# EAGLE design StormNet18-Remote-v0.1 (EAGLE 7.7.0)
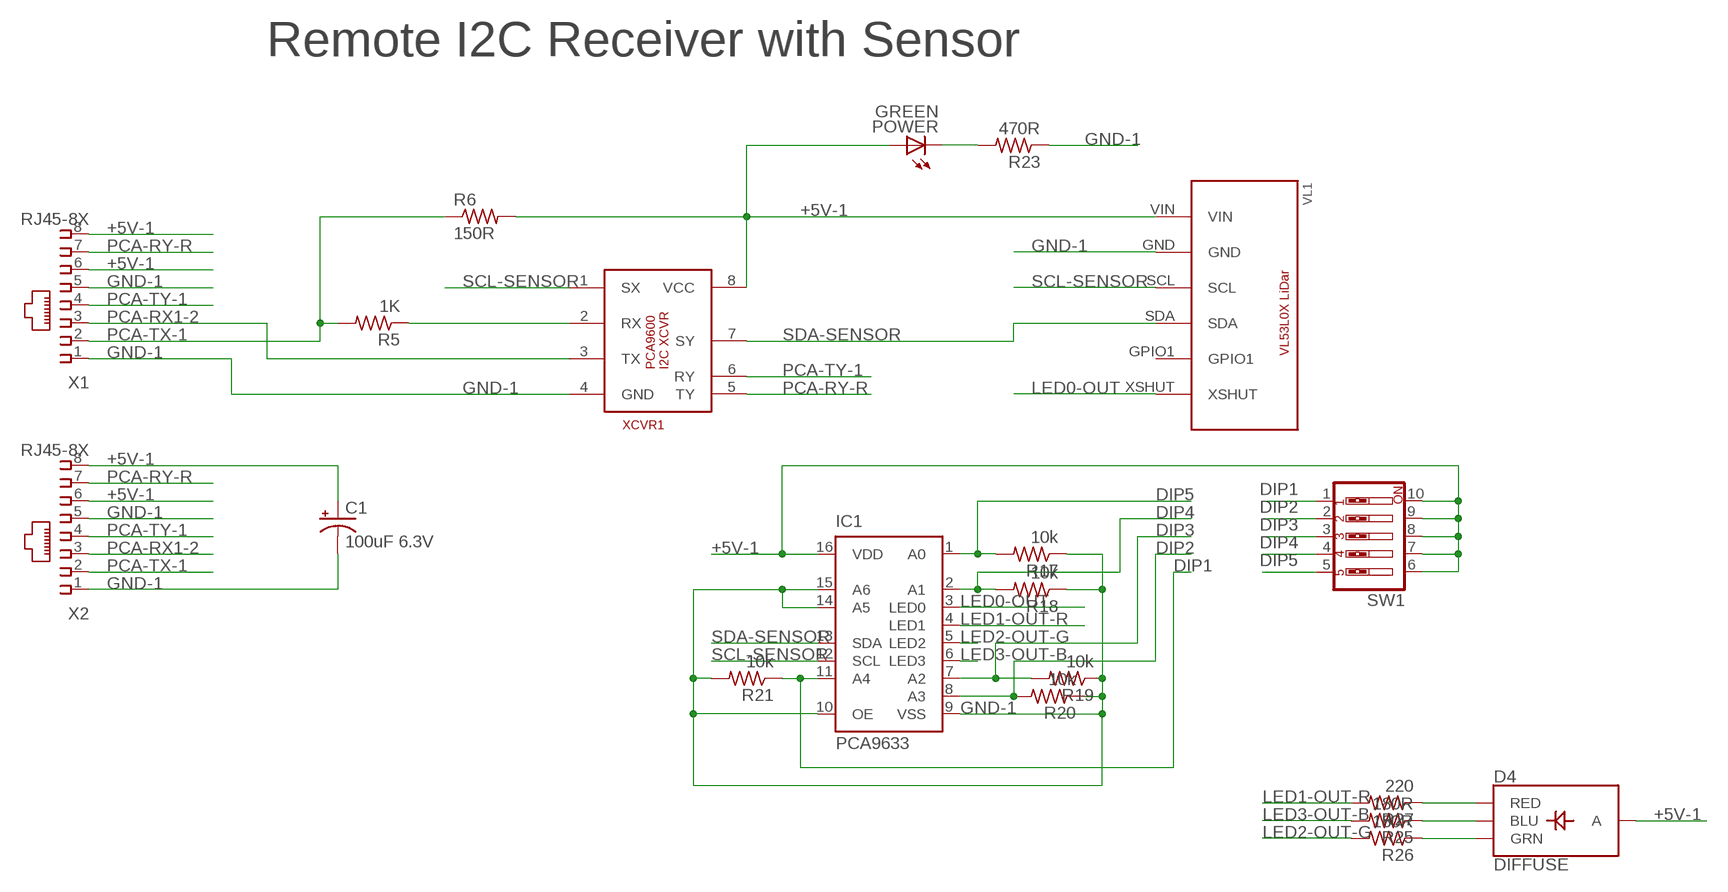
[diagram p0: schematic, sheet 1]

## Parts
C1  100uF 6.3V  CPOL-USCT3528  [CT3528]
D4  DIFFUSE  LED-RGB-CADIFFUSE  [LED-RGB-THRU]
IC1  PCA9633  [SO16]
POWER  GREEN  LEDCHIPLED_1206  [CHIPLED_1206]
R5  1K  R-US_R0603  [R0603]
R6  150R  R-US_R0603  [R0603]
R17  10k  R-US_R0603  [R0603]
R18  10k  R-US_R0603  [R0603]
R19  10k  R-US_R0603  [R0603]
R20  10k  R-US_R0603  [R0603]
R21  10k  R-US_R0603  [R0603]
R23  470R  R-US_R0603  [R0603]
R25  180R  R-US_R0603  [R0603]
R26  180R  R-US_R0603  [R0603]
R27  220  R-US_R0603  [R0603]
SW1  SW_DIP-5  [EDG-05]
VL1  VL53L0X-GREEN  [VL53L0X-GREEN]
X1  RJ45-8X  [RJ45-NO-SHIELD]
X2  RJ45-8X  [RJ45-NO-SHIELD]
XCVR1  PCA9600DSO8  [SO08]

## Nets
+5V-1 [PWR]: C1.+ D4.2(A) IC1.16(VDD) POWER.A R6.2 SW1.6 SW1.7 SW1.8 SW1.9 SW1.10 VL1.VIN X1.6 X1.8 X2.6 X2.8 XCVR1.8(VCC)
BLUE [PWR]: D4.4(BLU) R25.1
DIP1: IC1.11(A4) R21.1 SW1.1
DIP2: IC1.8(A3) R20.2 SW1.2
DIP3: IC1.7(A2) R19.2 SW1.3
DIP4: IC1.2(A1) R18.2 SW1.4
DIP5: IC1.1(A0) R17.2 SW1.5
GND-1 [PWR]: C1.- IC1.9(VSS) IC1.10(OE) IC1.14(A5) IC1.15(A6) R17.1 R18.1 R19.1 R20.1 R21.2 R23.1 VL1.GND X1.1 X1.5 X2.1 X2.5 XCVR1.4(GND)
GREEN [PWR]: D4.3(GRN) R26.1
LED0-OUT: IC1.3(LED0) VL1.XSHUT
LED1-OUT-R [PWR]: IC1.4(LED1) R27.2
LED2-OUT-G [PWR]: IC1.5(LED2) R26.2
LED3-OUT-B [PWR]: IC1.6(LED3) R25.2
N$2: R5.1 XCVR1.2(RX)
N$22: POWER.C R23.2
PCA-RX1-2: X1.3 X2.3 XCVR1.3(TX)
PCA-RY-R: X1.7 X2.7 XCVR1.5(TY)
PCA-TX-1: R5.2 R6.1 X1.2 X2.2
PCA-TY-1: X1.4 X2.4 XCVR1.6(RY)
RED [PWR]: D4.1(RED) R27.1
SCL-SENSOR: IC1.12(SCL) VL1.SCL XCVR1.1(SX)
SDA-SENSOR: IC1.13(SDA) VL1.SDA XCVR1.7(SY)
Unconnected: VL1.GPIO1

## Notes on the sheet
- Remote I2C Receiver with Sensor

## Library data of the parts
C1 = rcl:CPOL-US: POLARIZED CAPACITOR, American symbol
D4 = SparkFun-LED:LED-RGB-CA: LED-RGB Diffused Common Anode Packages: LED RGB-THRU P-LCC-4-3 LED-TRICOLOR-SMD SparkFun Products: RGB Diffused Common Anode- Diffuse <[https://www.sparkfun.com/products/10821]> RGB Diffused Common Anode - Clear <[https://www.sparkfun.com/products/10820]> Qduino Mini <[https://www.sparkfun.com/products/13614]> Triple Output LED RGB - SMD <https://www.sparkfun.com/products/7844>; PROD_ID: DIO-10632
IC1 = micro-philips:PCA9633: 4-bit I2C-bus and SMBus low power I/O port with LED drivers Source: www.nxp.com .. PCA9633.pdf
POWER = adafruit:LED: LED OSRAM: - CHIPLED LG R971, LG N971, LY N971, LG Q971, LY Q971, LO R971, LY R971 LH N974, LH R974 LS Q976, LO Q976, LY Q976 LO Q996 - Hyper CHIPLED LW Q18S LB Q993, LB Q99A, LB R99A - SideLED LS A670, LO A670, LY A670, LG A670, LP A670 LB A673, LV A673, LT A673, LW A673 LH A674 LY A675 LS A676, LA A676, LO A676, LY A676, LW A676 LS A679, LY A679, LG A679 - Hyper Micro SIDELED® LS Y876, LA Y876, LO Y876, LY Y876 LT Y87S - SmartLED LW L88C, LW L88S LB L89C, LB L89S, LG L890 LS L89K, LO L89K, LY L89K LS L896, LA L896, LO L896, LY L896 - TOPLED LS T670, LO T670, LY T670, LG T670, LP T670 LSG T670, LSP T670, LSY T670, LOP T670, LYG T670 LG T671, LOG T671, LSG T671 LB T673, LV T673, LT T673, LW T673 LH T674 LS T676, LA T676, LO T676, LY T676, LB T676, LH T676, LSB T676, LW T676 LB T67C, LV T67C, LT T67C, LS T67K, LO T67K, LY T67K, LW E67C LS E67B, LA E67B, LO E67B, LY E67B, LB E67C, LV E67C, LT E67C LW T67C LS T679, LY T679, LG T679 LS T770, LO T770, LY T770, LG T770, LP T770 LB T773, LV T773, LT T773, LW T773 LH T774 LS E675, LA E675, LY E675, LS T675 LS T776, LA T776, LO T776, LY T776, LB T776 LHGB T686 LT T68C, LB T68C - Hyper Mini TOPLED® LB M676 - Mini TOPLED Santana® LG M470 LS M47K, LO M47K, LY M47K Source: http://www.osram.convergy.de/
R5 R6 R17-R21 R23 R25-R27 = resistor:R-US_: RESISTOR, American symbol
SW1 = special:SW_DIP-5: DIP SWITCH
VL1 = Stormgears-2018:VL53L0X-GREEN
X1 X2 = con-tycoelectronics:RJ45: CORCOM Modular RJ Jacks No Shield Source: www.tycoelectronics.com .. ENG_DS_1654001_1099_RJ_L_0507.pdf; MPN: RJ45-8X; OC_FARNELL: unknown; OC_NEWARK: 16R6101
XCVR1 = adafruit:PCA9600D: NXP PCA9600 I2C long distance driver

## Net classes
1 PWR: width 0.508 mm

## Board
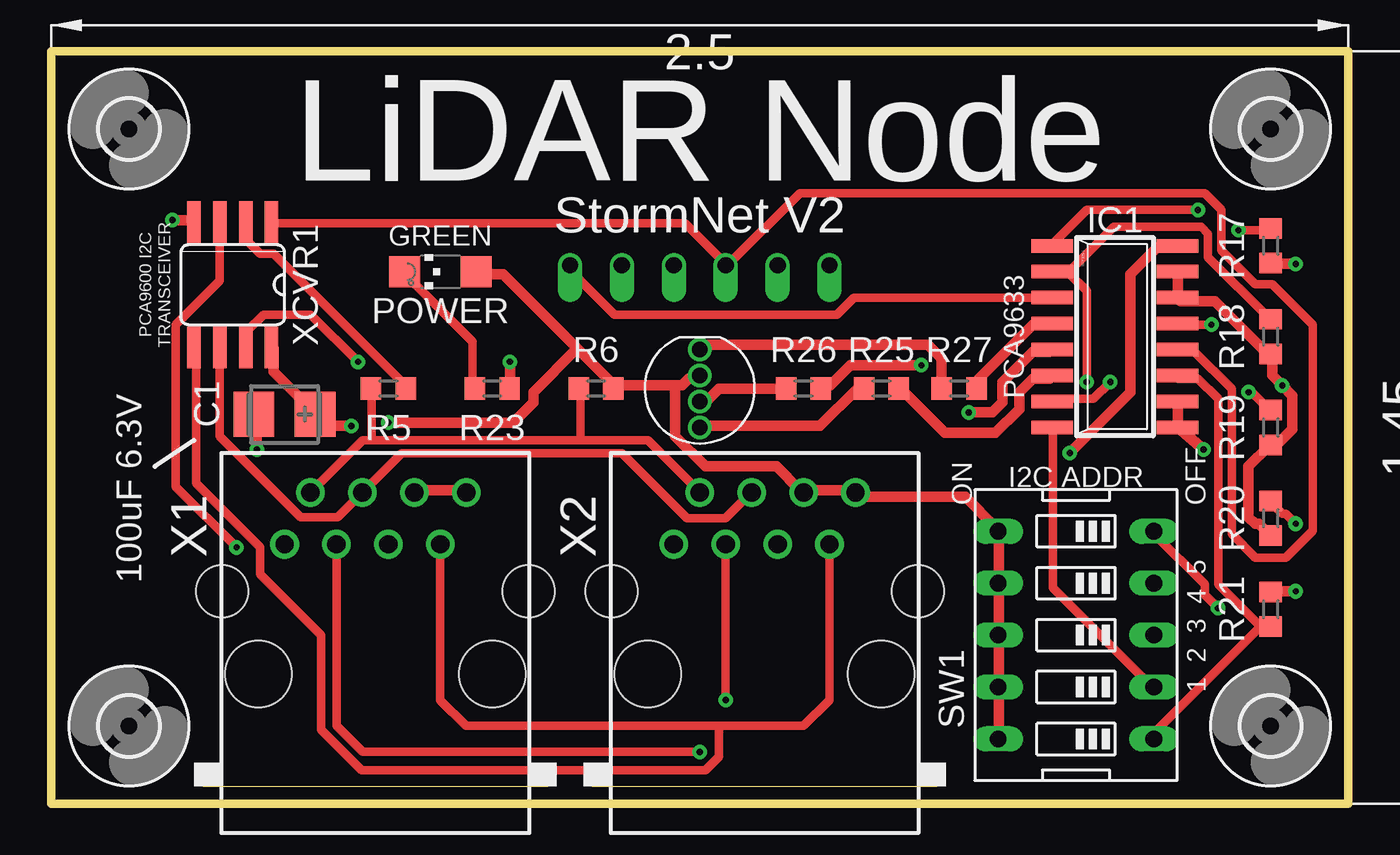
[diagram p1: board, top side]
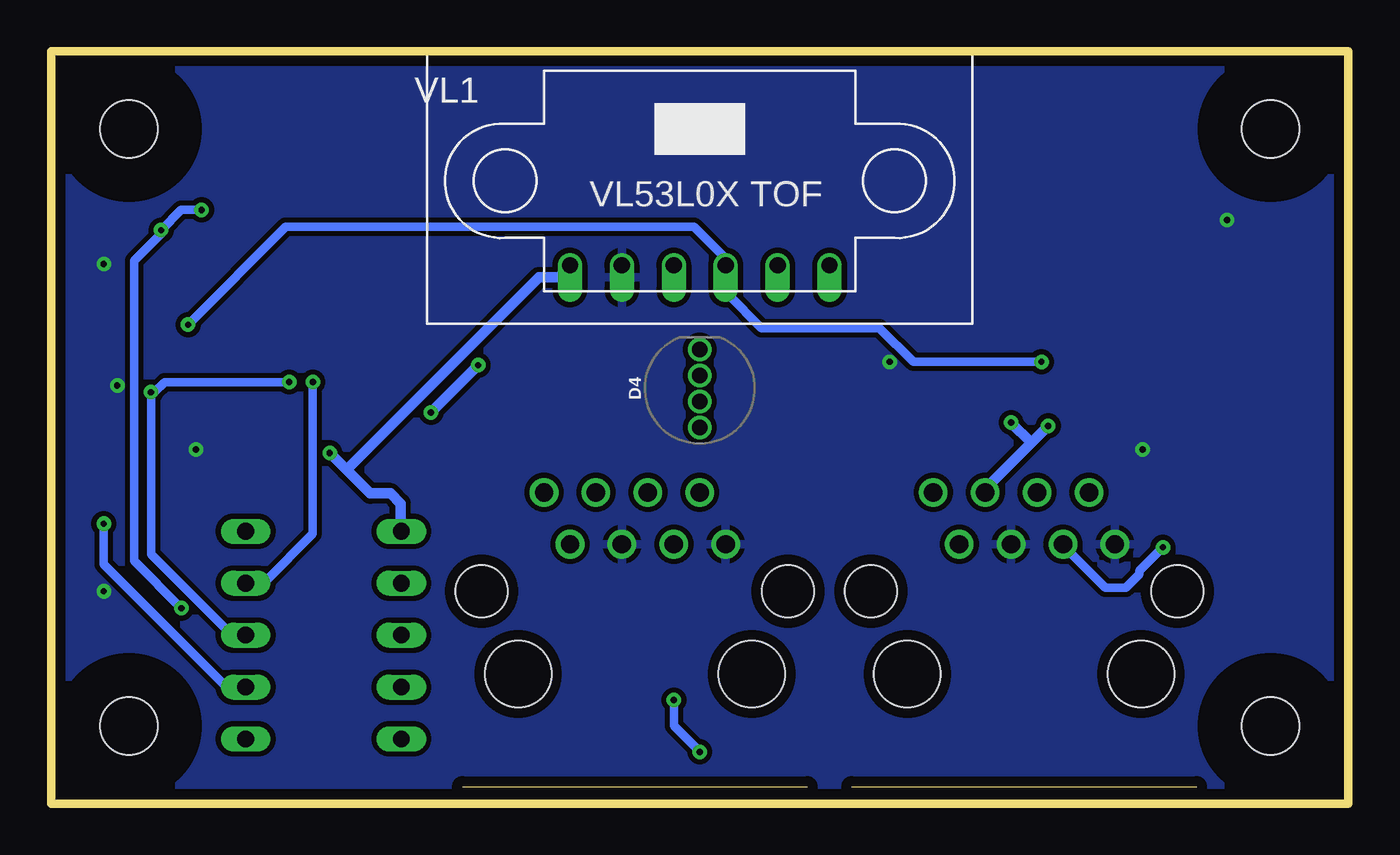
[diagram p2: board, bottom side, seen from below]

Size 63.5 x 36.83 mm. Coordinates in mm from the lower left corner, seen from the top.
Outline: 0,36.83 0,0 63.5,0 63.5,36.83 0,36.83
Copper layers (1*16): Top 0.035mm / dielectric 1.5mm / Bottom 0.035mm
Design rules "default *": minimum track width 16mil, minimum drill 12mil, track to track 10mil, track to pad 10mil, pad to pad 10mil, via to via 10mil, smd to smd 10mil, copper to edge 20mil, drill to drill 0.3mm, minimum pad ring 0mil, minimum via ring 8mil, stop-mask expansion 4mil, vias tented up to drill 0mil, thermal gap 10mil

### Footprints (pad centres in the part's own frame; a part is rotated, then mirrored left to right if it is on the bottom)
CT3528 = smd 2 x 2.2: + -1.5,0; - 1.5,0
LED-RGB-THRU = drill 0.762 pad 1.016: 1 1.905,0; 2 0.635,0; 3 -0.635,0; 4 -1.905,0
SO16 = smd 0.66 x 2.032: 1 -4.445,-3.073; 2 -3.175,-3.073; 3 -1.905,-3.073; 4 -0.635,-3.073; 5 0.635,-3.073; 6 1.905,-3.073; 7 3.175,-3.073; 8 4.445,-3.073; 9 4.445,3.073; 10 3.175,3.073; 11 1.905,3.073; 12 0.635,3.073; 13 -0.635,3.073; 14 -1.905,3.073; 15 -3.175,3.073; 16 -4.445,3.073
CHIPLED_1206 = smd 1.5 x 1.5: A 0,-1.75; C 0,1.75
R0603 = smd 1 x 1.1: 1 -0.85,0; 2 0.85,0
EDG-05 = drill 0.813 long: 1 -5.08,-3.81; 2 -2.54,-3.81; 3 0,-3.81; 4 2.54,-3.81; 5 5.08,-3.81; 6 5.08,3.81; 7 2.54,3.81; 8 0,3.81; 9 -2.54,3.81; 10 -5.08,3.81
2,8 = hole 2.8: 0,0
VL53L0X-GREEN = drill 0.8 offset: GND -3.81,-4.128; GPIO1 3.81,-4.128; SCL -1.27,-4.128; SDA 1.27,-4.128; VIN -6.35,-4.128; XSHUT 6.35,-4.128
RJ45-NO-SHIELD = drill 0.9 pad 1.4: 1 -4.445,6.35; 2 -3.175,8.89; 3 -1.905,6.35; 4 -0.635,8.89; 5 0.635,6.35; 6 1.905,8.89; 7 3.175,6.35; 8 4.445,8.89 | hole 3.251: -5.715,0; 5.715,0 | hole 2.55: 7.5,4.05; -7.5,4.05
SO08 = smd 0.66 x 2.032: 1 -1.905,-3.073; 2 -0.635,-3.073; 3 0.635,-3.073; 4 1.905,-3.073; 5 1.905,3.073; 6 0.635,3.073; 7 -0.635,3.073; 8 -1.905,3.073

### Placement (x,y rotation side)
C1  11.43,19.05 180 top
D4  31.75,20.32 90 bottom
IC1  52.07,22.86 270 top
POWER  19.05,26.04 90 top
R5  16.51,20.32 180 top
R6  26.67,20.32 0 top
R17  59.69,27.3 90 top
R18  59.69,22.86 90 top
R19  59.69,18.41 90 top
R20  59.69,13.97 90 top
R21  59.69,9.53 90 top
R23  21.59,20.32 180 top
R25  40.64,20.32 0 top
R26  36.83,20.32 0 top
R27  44.45,20.32 0 top
SW1  50.16,8.26 90 top
U$5  [2,8]  3.81,33.02 270 top
U$6  [2,8]  3.81,3.81 270 top
U$7  [2,8]  59.69,3.81 270 top
U$8  [2,8]  59.69,33.02 270 top
VL1  31.75,30.48 0 bottom
X1  15.88,6.35 0 top
X2  34.92,6.35 0 top
XCVR1  8.89,25.4 180 top

### Tracks (layer width: path | path; a pad name or v marks a point on that pad's centre or on a via)
+5V-1  (via drill 0.3)
  Top 0.508: 30.54,20.47 30.87,20.47 31.2,20.8 31.7,20.8 D4.2 | 30.54,20.47 27.57,20.47 R6.2 27.41,20.64 25.76,22.29 | SW1.10 46.39,3.3 46.39,5.61 SW1.9 46.39,5.94 46.39,8.26 SW1.8 46.39,8.42 46.39,10.57 SW1.7 46.39,10.9 46.39,13.21 SW1.6 46.23,13.54 44.74,15.02 39.46,15.02 X2.8 39.29,15.35 36.98,15.35 X2.6 36.65,15.35 35.5,16.51 32.03,16.51 30.54,18 30.54,20.47 | v49.86,17.17 52.83,20.14 52.83,25.92 54.15,27.24 55.14,27.24 IC1.16 | X1.8 20.31,15.35 17.83,15.35 X1.6 | 25.76,22.29 22.12,25.92 20.8,25.92 POWER.A | XCVR1.8 10.9,22.29 10.9,21.13 12.88,19.15 C1.+ 13.04,18.99 13.54,18.49 v14.69,18.49 | 25.76,22.29 23.61,20.14 23.61,19.65 22.62,18.66 v16.51,18.66
  Bottom 0.508: 49.03,16.34 47.88,15.19 46.89,15.19 46.39,14.69 46.39,13.37 SW1.6 | 49.03,16.34 v49.86,17.17 | 49.03,16.34 39.62,25.76 38.63,25.76 38.14,26.25 VL1.VIN | v14.69,18.49 15.52,17.67 | 15.52,17.67 17.67,15.52 17.67,15.35 X1.6 | 15.52,17.67 v16.51,18.66
BLUE
  Top 0.508: R25.1 39.79,20.31 39.46,20.31 37.64,18.49 31.86,18.49 D4.4
DIP1
  Top 0.406: 59.11,8.59 59.6,8.59 R21.1 | 59.11,8.59 53.82,3.3 SW1.1 | IC1.11 55.14,20.8 56.13,20.8 57.12,19.81 57.12,10.73 59.11,8.75 59.11,8.59
DIP2  (via drill 0.3)
  Top 0.406: v60.92,13.7 60.43,14.2 60.26,14.2 59.77,14.69 R20.2 | IC1.8 49.03,18.33 49.03,10.57 53.82,5.78 SW1.2
  Bottom 0.406: v60.92,13.7 60.92,11.72 54.98,5.78 53.99,5.78 SW1.2
DIP3  (via drill 0.3)
  Top 0.406: v58.61,20.14 58.78,20.14 59.6,19.32 R19.2 | v51.84,20.64 51.02,19.81 49.03,19.81 IC1.7
  Bottom 0.406: SW1.3 54.65,8.26 58.61,12.22 v58.61,20.14 58.45,20.14 57.95,20.64 v51.84,20.64
DIP4  (via drill 0.3)
  Top 0.406: R18.2 59.6,23.77 56.63,26.75 56.63,27.9 56.3,28.23 52.01,28.23 49.86,26.09 49.03,26.09 IC1.2 49.86,25.92 50.69,25.09 v50.69,20.64
  Bottom 0.406: v50.69,20.64 50.69,13.21 53,10.9 53.82,10.9 SW1.4
DIP5  (via drill 0.3)
  Top 0.406: v58.12,28.07 59.6,28.07 R17.2 | v56.13,29.06 50.69,29.06 49.03,27.41 IC1.1 | v57.12,9.58 56.46,10.24 56.46,10.73 53.99,13.21 SW1.5
  Bottom 0.406: v56.13,29.06 57.12,29.06 v58.12,28.07 58.12,27.9 59.44,26.58 59.44,11.89 v57.12,9.58
GND-1  (via drill 0.3)
  Top 0.508: IC1.15 IC1.14 55.31,24.6 56.96,24.6 59.6,21.96 R18.1 59.77,21.96 59.77,20.97 v60.26,20.47 60.76,19.98 60.76,18.33 59.93,17.5 R19.1 59.6,17.5 58.61,16.51 58.61,14.03 58.94,13.7 59.11,13.7 59.6,13.21 R20.1 | IC1.10 IC1.9 v56.41,17.34 | v22.45,21.63 22.45,20.47 R23.1 | v60.92,10.4 59.77,10.4 R21.2 | v60.92,26.42 59.77,26.42 R17.1 | v5.94,28.56 6.93,28.56 XCVR1.4 | v10.07,17.34 10.07,18.99 C1.-
  pour Bottom: 0,36.83 0,0 63.5,0 63.5,36.83
GREEN
  Top 0.508: R26.1 35.83,20.31 32.69,20.31 32.19,19.81 31.86,19.81 D4.3
LED0-OUT
  Top 0.406: IC1.3 39.29,24.77 38.47,23.94 27.57,23.94 25.26,26.25 VL1.XSHUT
LED1-OUT-R
  Top 0.508: R27.2 45.4,20.47 45.4,20.8 48.04,23.44 48.87,23.44 IC1.4
LED2-OUT-G  (via drill 0.3)
  Top 0.508: v42.6,21.46 39.13,21.46 38.14,20.47 37.81,20.47 R26.2 | v44.91,19.15 46.06,19.15 46.56,19.65 46.56,20.64 48.04,22.12 48.87,22.12 IC1.5
  Bottom 0.508: v44.91,19.15 v42.6,21.46
LED3-OUT-B
  Top 0.508: R25.2 41.6,20.31 43.75,18.16 46.23,18.16 47.38,19.32 47.38,20.14 48.04,20.8 48.87,20.8 IC1.6
N$2
  Top 0.406: R5.1 17.34,20.47 10.9,26.91 10.24,26.91 9.58,27.57 9.58,28.4 XCVR1.2
N$22
  Top 0.406: R23.2 20.64,20.47 20.64,22.62 17.34,25.92 POWER.C
PCA-RX1-2  (via drill 0.3)
  Top 0.406: X1.3 13.97,3.81 15.24,2.54 v31.75,2.54 | v33.02,5.08 X2.3 | XCVR1.3 8.26,25.59 6.11,23.44 6.11,15.52 v9.08,12.55
  Bottom 0.406: v31.75,2.54 33.02,3.81 v33.02,5.08 | v9.08,12.55 10.24,11.39 10.24,11.23 10.9,10.57 11.89,10.57 13.87,12.55 X1.3
PCA-RY-R
  Top 0.406: X1.7 19.05,5.08 20.32,3.81 32.69,3.81 | 32.69,3.81 36.83,3.81 38.1,5.08 X2.7 | 32.69,3.81 32.69,2.31 32.03,1.65 15.19,1.65 13.21,3.63 13.21,8.26 10.24,11.23 10.24,12.55 7.1,15.68 7.1,22.29 XCVR1.5
PCA-TX-1
  Top 0.406: X1.2 15.24,17.78 15.68,17.78 | 15.68,17.78 25.92,17.78 | 25.92,17.78 29.21,17.78 X2.2 | 15.68,17.78 15.68,20.31 R5.2 | 25.92,17.78 25.92,20.31 R6.1
PCA-TY-1
  Top 0.406: X2.4 33.02,13.97 31.11,13.97 27.94,17.14 17.14,17.14 X1.4 14.03,14.03 12.22,14.03 8.26,18 XCVR1.6
RED
  Top 0.508: R27.1 43.59,20.47 43.59,21.79 42.93,22.45 32.03,22.45 31.86,22.29 D4.1
SCL-SENSOR
  Top 0.406: XCVR1.1 10.9,28.4 31.04,28.4 33.02,26.42 VL1.SCL 33.19,26.42 36.65,29.88 56.46,29.88 57.29,29.06 57.29,27.08 58.94,25.43 59.77,25.43 61.75,23.44 61.75,13.37 60.43,12.05 58.94,12.05 57.78,13.21 57.78,20.31 55.97,22.12 55.14,22.12 IC1.12
SDA-SENSOR  (via drill 0.3)
  Top 0.406: v15.02,21.63 12.71,23.94 10.4,23.94 9.58,23.11 9.58,22.45 XCVR1.7 | v56.79,23.44 55.14,23.44 IC1.13
  Bottom 0.406: v15.02,21.63 21.3,21.63 22.95,23.28 28.73,23.28 30.38,24.93 30.38,26.25 VL1.SDA 30.54,26.42 30.54,26.75 32.03,28.23 52.01,28.23 v56.79,23.44

### Text on the board
tPlace: LiDAR Node
tNames: StormNet V2 | GREEN | PCA9633 | I2C ADDR | ON | OFF | 1 2 3 4 5